# Altium schematic sheet Block_Diagram.SchDoc
size A4; SheetNumber: 2; SheetTotal: 8
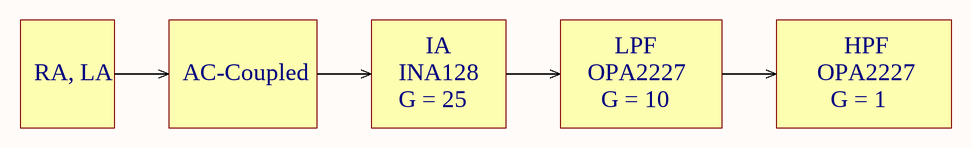
[diagram p0: Block_Diagram.SchDoc]

## Notes on the sheet
- RA, LA
- AC-Coupled
- INA128
- IA
- OPA2227
- LPF
- HPF
- G = 25
- G = 10
- G = 1
- Title:
- Date:
- Time:
- Drawn by:
- Phung Nhat Minh
- Sheet
- of